# Altium project Smart_Home.PrjPcb
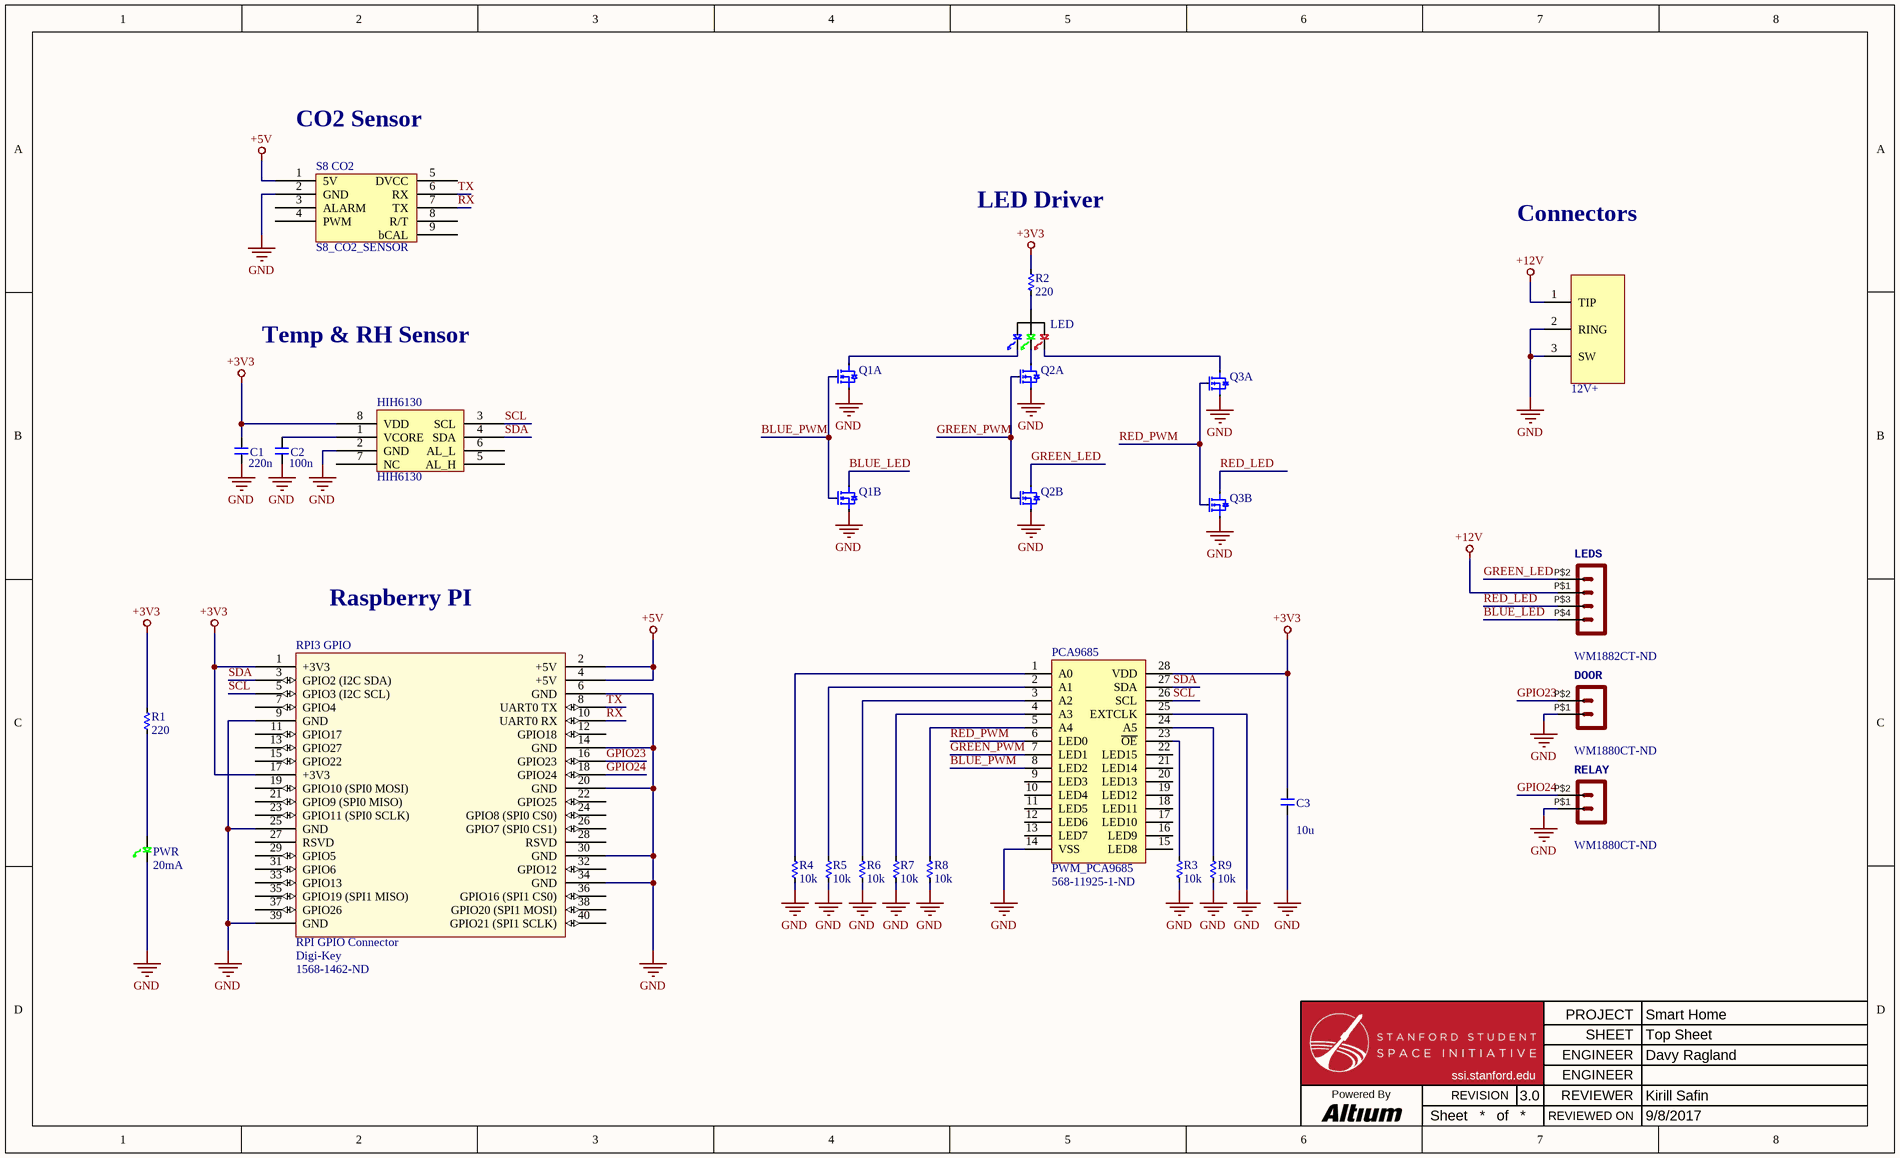
[diagram p0: TopSheet.SchDoc]
prjEngineer1: Davy Ragland; prjReviewDate: 9/8/2017; prjReviewer: Kirill Safin; prjRevision: 3.0; prjTitle: Smart Home
1 sheet, 25 parts. Net scope: strictly hierarchical (ports join the sheet entries above them; power ports are local).
Board file: TopSheet.PcbDoc

## Sheet TopSheet.SchDoc: Top Sheet
size Legal; Project: World Domination Satellite

### Parts
12V+  CONN_BARREL_21X55_PJ-102A  [CUI_21x55_BARREL]  (value not drawn)
C1  human_value: 220n  [C0805]  (hidden comment: __template_cap)
C2  human_value: 100n  [C0805]  (hidden comment: __template_cap)
C3  human_value: 10u  [C0805]  (hidden comment: __template_cap)
DOOR  Supplier Part Number 1: WM1880CT-ND  [43650-0209]  (hidden comment: Molex - Micro-Fit 3.0 Series connector,  3.00mm (0.118") pitch header, 2 positions.)
HIH6130  HIH6130  [8SOIC150]
LED  LED_LTST-C19HE1WT  [LED_LITEON_LTST-C19HE1WT]  (value not drawn)
LEDS  Supplier Part Number 1: WM1882CT-ND  [43650-0409]  (hidden comment: Molex - Micro-Fit 3.0 Series connector,  3.00mm (0.118") pitch header, 4 positions.)
PCA9685  PWM_PCA9685  Supplier Part Number 1: 568-11925-1-ND  [28TSSOP65]
PWR  Current - Test: 20mA  [0805_Diode]  (hidden comment: LED_LY971)
Q1  NFET_SI7232DN  [POWERPAK_1212-8_DUAL]  (value not drawn)  (parts A,B of 2)
Q2  NFET_SI7232DN  [POWERPAK_1212-8_DUAL]  (value not drawn)  (parts A,B of 2)
Q3  NFET_SI7232DN  [POWERPAK_1212-8_DUAL]  (value not drawn)  (parts A,B of 2)
R1  value 220  [R0805]  (hidden comment: __template_resistor)
R2  value 220  [R0805]  (hidden comment: __template_resistor)
R3  value 10k  [R0805]  (hidden comment: __template_resistor)
R4  value 10k  [R0805]  (hidden comment: __template_resistor)
R5  value 10k  [R0805]  (hidden comment: __template_resistor)
R6  value 10k  [R0805]  (hidden comment: __template_resistor)
R7  value 10k  [R0805]  (hidden comment: __template_resistor)
R8  value 10k  [R0805]  (hidden comment: __template_resistor)
R9  value 10k  [R0805]  (hidden comment: __template_resistor)
RELAY  Supplier Part Number 1: WM1880CT-ND  [43650-0209]  (hidden comment: Molex - Micro-Fit 3.0 Series connector,  3.00mm (0.118") pitch header, 2 positions.)
RPI3_GPIO  RPI GPIO Connector  Supplier 1: Digi-Key  Supplier Part Number 1: 1568-1462-ND  [rpi]
S8_CO2  S8_CO2_SENSOR  [S8 CO2 SENSOR]

### Nets
+3V3: C1.1 C3.1 HIH6130.8(VDD) PCA9685.28(VDD) R1.1 R2.1 RPI3_GPIO.1(+3V3) RPI3_GPIO.17(+3V3)
+5V: RPI3_GPIO.2(+5V) RPI3_GPIO.4(+5V) S8_CO2.1(5V)
+12V: 12V+.1(TIP) LEDS.P$1
GND: 12V+.2(RING) 12V+.3(SW) C1.2 C2.2 C3.2 DOOR.P$1 HIH6130.2(GND) PCA9685.14(VSS) PCA9685.25(EXTCLK) PWR.1 Q1.1 Q1.3 Q2.1 Q2.3 Q3.1 Q3.3 R3.2 R4.2 R5.2 R6.2 R7.2 R8.2 R9.2 RELAY.P$1 RPI3_GPIO.6(GND) RPI3_GPIO.9(GND) RPI3_GPIO.14(GND) RPI3_GPIO.20(GND) RPI3_GPIO.25(GND) RPI3_GPIO.30(GND) RPI3_GPIO.34(GND) RPI3_GPIO.39(GND) S8_CO2.2(GND)
BLUE_LED: LEDS.P$4 Q1.5
BLUE_PWM: PCA9685.8(LED2) Q1.2 Q1.4
GPIO23: DOOR.P$2 RPI3_GPIO.16(GPIO23)
GPIO24: RELAY.P$2 RPI3_GPIO.18(GPIO24)
GREEN_LED: LEDS.P$2 Q2.5
GREEN_PWM: PCA9685.7(LED1) Q2.2 Q2.4
RED_LED: LEDS.P$3 Q3.5
RED_PWM: PCA9685.6(LED0) Q3.2 Q3.4
RX: RPI3_GPIO.10(UART0_RX) S8_CO2.7(TX)
SCL: HIH6130.3(SCL) PCA9685.26(SCL) RPI3_GPIO.5(GPIO3_(I2C_SCL))
SDA: HIH6130.4(SDA) PCA9685.27(SDA) RPI3_GPIO.3(GPIO2_(I2C_SDA))
TX: RPI3_GPIO.8(UART0_TX) S8_CO2.6(RX)
NetC2_1: C2.1 HIH6130.1(VCORE)
NetLED_1: LED.1 Q3.7
NetLED_2: LED.2 Q2.7
NetLED_3: LED.3 Q1.7
NetLED_4: LED.4 R2.2
NetPCA9685_1: PCA9685.1(A0) R4.1
NetPCA9685_2: PCA9685.2(A1) R5.1
NetPCA9685_3: PCA9685.3(A2) R6.1
NetPCA9685_4: PCA9685.4(A3) R7.1
NetPCA9685_5: PCA9685.5(A4) R8.1
NetPCA9685_23: PCA9685.23(~{OE}) R3.1
NetPCA9685_24: PCA9685.24(A5) R9.1
NetPWR_2: PWR.2 R1.2

Not connected (* = marked no-connect by the designer): HIH6130 5(AL_H) 6(AL_L) 7(NC); PCA9685 9(LED3) 10(LED4) 11(LED5) 12(LED6) 13(LED7) 15(LED8) 16(LED9) 17(LED10) 18(LED11) 19(LED12) 20(LED13) 21(LED14) 22(LED15); RPI3_GPIO 7(GPIO4) 11(GPIO17) 12(GPIO18) 13(GPIO27) 15(GPIO22) 19(GPIO10_(SPI0_MOSI)) 21(GPIO9_(SPI0_MISO)) 22(GPIO25) 23(GPIO11_(SPI0_SCLK)) 24(GPIO8_(SPI0_CS0)) 26(GPIO7_(SPI0_CS1)) 27(RSVD) 28(RSVD) 29(GPIO5) 31(GPIO6) 32(GPIO12) 33(GPIO13) 35(GPIO19_(SPI1_MISO)) 36(GPIO16_(SPI1_CS0)) 37(GPIO26) 38(GPIO20_(SPI1_MOSI)) 40(GPIO21_(SPI1_SCLK)); S8_CO2 3(ALARM) 4(PWM) 5(DVCC) 8(R/T) 9(bCAL)

### Notes on the sheet
- (near S8_CO2) CO2 Sensor
- LED Driver
- Connectors
- Temp & RH Sensor
- Raspberry PI
- PROJECT
- SHEET
- Powered By
- Sheet
- of
- REVISION
- ssi.stanford.edu
- ENGINEER
- REVIEWER
- REVIEWED ON

### Library data of the parts
12V+ = CONN_BARREL_21X55_PJ-102A: CONN JACK POWER 2.1MM PCB; Manufacturer: CUI Inc; Gender: Male; Plug/Mating Plug Diameter: 2.1mm ID, 5.5mm OD; Number of Positions/Contacts: 2 Conductors, 3 Contacts; Internal Switch(s): Single Switch, Normally Closed; Shielding: Unshielded; Voltage - Rated: 16VDC; Current Rating: 2.5A; Supplier 1: Digi-Key; Manufacturer Part Number: PJ-102A; RoHS: RoHS Compliant; Category: Connectors, Interconnects; Stock 1: 149280; Pricing 1: 1=0.92, 10=0.644, 100=0.4324, 500=0.3496, 1000=0.3128, 2500=0.2484 (USD); Connector Type: Jack; Mounting Type: Through Hole, Right Angle; Termination: Solder; Features: -; Color: Black; Contact Material: Copper; Contact Material - Plating: Nickel; Housing Color: Black; Housing Material: Thermoplastic; Operating Temperature: -25°C ~ 85°C; ComponentLink1URL: http://products.cui.com/GetSpecForDigiKey.aspx?MFGNum=PJ-102A; ComponentLink1Description: Datasheet; Supplier Part Number 1: CP-102A-ND
C1 = CAP CER 0.22UF 16V 10% X7R 0805: voltage: 16.0; type: capacitor; value: 2.2e-07; tolerance: 10%; package: 0805; Supplier 1: Digikey; Supplier Part Number 1: 478-1400-1-ND; price: 0.225
C2 = CAP CER 0.1UF 50V 20% X7R 0805: voltage: 50.0; type: capacitor; value: 1e-07; tolerance: 20%; package: 0805; Supplier 1: Digikey; Supplier Part Number 1: 478-3351-1-ND; price: 0.1
C3 = CAP CER 10UF 6.3V 10% X5R 0805: voltage: 6.3; type: capacitor; value: 1e-05; tolerance: 10%; package: 0805; Supplier 1: Digikey; Supplier Part Number 1: 478-1417-1-ND; price: 0.275
DOOR RELAY = HEADER_POS2_?43650-0209: Manufacturer: Molex, LLC; Manufacturer Part Number: 0436500209; Connector Type: Header, Shrouded; Number of Positions: 2; Number of Positions Loaded: All; Pitch: 0.118" (3.00mm); Supplier 1: Digi-Key; RoHS: RoHS Compliant; Category: Connectors, Interconnects; Stock 1: 9302; Pricing 1: 1=2.03, 10=1.841, 50=1.6534, 100=1.5782 (USD); Packaging: Cut Tape (CT); Contact Type: Male Pin; Number of Rows: 1; Row Spacing: -; Contact Mating Length: -; Mounting Type: Surface Mount, Right Angle; Termination: Solder; Fastening Type: Locking Ramp; Features: Board Lock; Contact Finish: Tin; Contact Finish Thickness: 100µin (2.54µm); Color: Black; ComponentLink1URL: http://www.molex.com/pdm_docs/sd/436500210_sd.pdf; ComponentLink1Description: http://www.molex.com/pdm_docs/sd/436500210_sd.pdf
HIH6130 = HIH6130: Humidity Temperature Sensor 0 ~ 100% RH I²C ±4% RH 6s Surface Mount
LED = LED_LTST-C19HE1WT: LED RGB DIFFUSED 0606; Manufacturer: Lite-On Inc.; Lens Color: White; Millicandela Rating: 112.5mcd Red, 281mcd Green, 104mcd Blue; Lens Style/Size: Rectangle with Flat Top, 1.15mm x 1.60mm; Voltage - Forward (Vf) (Typ): 2.1V Red, 3.35V Green, 3.35V Blue; Current - Test: 20mA Red, 20mA Green, 20mA Blue; Viewing Angle: 130°; Wavelength - Dominant: 624nm Red, 525nm Green, 470nm Blue; Wavelength - Peak: 632nm Red, 520nm Green, 468nm Blue; Supplier 1: Digi-Key; Manufacturer Part Number: LTST-C19HE1WT; RoHS: RoHS Compliant; Category: Optoelectronics; Stock 1: 408608; Pricing 1: 1=0.59, 10=0.424, 25=0.3464, 100=0.277, 250=0.23372, 500=0.19912, 1000=0.15583 (USD); Packaging: Cut Tape (CT); Part Status: Active; Color: Red, Green, Blue (RGB); Lens Transparency: Diffused; Mounting Type: Surface Mount; Features: -; Package / Case: 0606 (1616 Metric); Supplier Device Package: *; Size / Dimension: 1.60mm L x 1.60mm W; Height (Max): 0.35mm; ComponentLink1URL: http://optoelectronics.liteon.com/upload/download/DS22-2008-0044/S_110_LTST-C19HE1WT.pdf; ComponentLink1Description: http://optoelectronics.liteon.com/upload/download/DS22-2008-0044/S_110_LTST-C19HE1WT.pdf; Supplier Part Number 1: 160-2162-1-ND
LEDS = HEADER_POS4_?43650-0409: Manufacturer: Molex, LLC; Manufacturer Part Number: 0436500409; Connector Type: Header, Shrouded; Number of Positions: 4; Number of Positions Loaded: All; Pitch: 0.118" (3.00mm); Supplier 1: Digi-Key; RoHS: RoHS Compliant; Category: Connectors, Interconnects; Stock 1: 1572; Pricing 1: 1=2.73, 10=2.474, 50=2.2216, 100=2.1206 (USD); Packaging: Cut Tape (CT); Contact Type: Male Pin; Number of Rows: 1; Row Spacing: -; Contact Mating Length: -; Mounting Type: Surface Mount, Right Angle; Termination: Solder; Fastening Type: Locking Ramp; Features: Board Lock; Contact Finish: Tin; Contact Finish Thickness: 100µin (2.54µm); Color: Black; ComponentLink1URL: http://www.molex.com/pdm_docs/sd/436500210_sd.pdf; ComponentLink1Description: http://www.molex.com/pdm_docs/sd/436500210_sd.pdf
PCA9685 = PWM_PCA9685: Manufacturer: NXP USA Inc.; Manufacturer Part Number: PCA9685PW,118; Internal Switch(s): Yes; Number of Outputs: 16; Voltage - Supply (Min): 2.3V; Voltage - Supply (Max): 5.5V; Current - Output / Channel: 25mA; Dimming: PWM; Supplier 1: Digi-Key; RoHS: RoHS Compliant; Category: Integrated Circuits (ICs); Stock 1: 2350; Pricing 1: 1=2.31, 10=2.075, 100=1.6644, 500=1.368, 1000=1.1324 (USD); Packaging: Cut Tape (CT); Part Status: Active; Type: Linear; Topology: -; Voltage - Output: 5.5V; Frequency: -; Applications: Backlight; Operating Temperature: -40°C ~ 85°C (TA); Mounting Type: Surface Mount; Package / Case: 28-TSSOP (0.173", 4.40mm Width); Supplier Device Package: 28-TSSOP; ComponentLink1URL: http://www.nxp.com/documents/data_sheet/PCA9685.pdf; ComponentLink1Description: http://www.nxp.com/documents/data_sheet/PCA9685.pdf
PWR = LED_LY971: LED 0805 GREEN 20MA; Manufacturer: OSRAM Opto Semiconductors Inc; Manufacturer Part Number: LG R971-KN-1; Wavelength - Dominant: 570nm; Wavelength - Peak: 572nm; Millicandela Rating: 26.05mcd; Voltage - Forward (Vf) (Typ): 2.2V; Viewing Angle: 160°; Lens Transparency: Diffused; Lens Color: White; Lens Style/Size: Rectangle with Flat Top, 1.30mm x 1.25mm; Supplier 1: Digi-Key; RoHS: RoHS Compliant; Category: Optoelectronics; Stock 1: 89733; Pricing 1: 1=0.08, 10=0.069, 100=0.0548, 250=0.04796, 500=0.04384 (USD); Packaging: Cut Tape (CT); Color: Green; Package / Case: 0805 (2012 Metric); Supplier Device Package: *; Size / Dimension: 2.00mm L x 1.25mm W; Height (Max): 0.80mm; Mounting Type: Surface Mount; ComponentLink1URL: http://www.osram-os.com/Graphics/XPic9/00078860_0.pdf; ComponentLink1Description: http://www.osram-os.com/Graphics/XPic9/00078860_0.pdf; Supplier Part Number 1: 475-1410-1-ND
Q1-Q3 = NFET_SI7232DN: MOSFET 2N-CH 20V 25A PPAK 1212-8; Manufacturer: Vishay Siliconix; Manufacturer Part Number: SI7232DN-T1-GE3; FET Type: 2 N-Channel (Dual); FET Feature: Logic Level Gate; Rds On (Max) @ Id, Vgs: 16.4 mOhm @ 10A, 4.5V; Vgs(th) (Max) @ Id: 1V @ 250µA; Gate Charge (Qg) @ Vgs: 32nC @ 8V; Input Capacitance (Ciss) @ Vds: 1220pF @ 10V; Power - Max: 23W; Supplier 1: Digi-Key; RoHS: RoHS Compliant; Category: Discrete Semiconductor Products; Stock 1: 2311; Pricing 1: 1=0.89, 10=0.782, 25=0.7344, 100=0.5994, 250=0.55672, 500=0.4738, 1000=0.37904 (USD); Packaging: Cut Tape (CT); Part Status: Active; Drain to Source Voltage (Vdss): 20V; Current - Continuous Drain (Id) @ 25°C: 25A; Operating Temperature: -55°C ~ 150°C (TJ); Mounting Type: Surface Mount; Package / Case: PowerPAK® 1212-8 Dual; Supplier Device Package: PowerPAK® 1212-8 Dual; ComponentLink1URL: http://www.vishay.com/docs/68986/si7232dn.pdf; ComponentLink1Description: http://www.vishay.com/docs/68986/si7232dn.pdf; Supplier Part Number 1: SI7232DN-T1-GE3CT-ND
R1 R2 = RES 220 OHM 1/8W 1% 0805 SMD: Manufacturer Part Number: CRCW0805220RFKEA; Manufacturer: Vishay Dale; Resistance (Machine readable): 220.00; Unit Price (USD): 0.089; Tolerance: ±1%; Power (Watts): 0.125W, 1/8W; Supplier Part Number: 541-220CCT-ND; type: resistor; Supplier 1: Digikey; Supplier Part Number 1: 541-220CCT-ND; Supplier 2: Mouser; Supplier Part Number 2: 71-CRCW0805-220-E3; Packaging: Cut Tape (CT); Series: CRCW; Package: 0805 (2012 Metric); Mouser PN Opt 1: 71-CRCW0805220RFKEA; Mouser PN Opt 2: 71-CRCW0805-220-E3
R3-R9 = RES 10.0K OHM 1/8W 1% 0805 SMD: Manufacturer Part Number: CRCW080510K0FKEA; Manufacturer: Vishay Dale; Resistance (Machine readable): 10000.00; Unit Price (USD): 0.089; Tolerance: ±1%; Power (Watts): 0.125W, 1/8W; Supplier Part Number: 541-10.0KCCT-ND; type: resistor; Supplier 1: Digikey; Supplier Part Number 1: 541-10.0KCCT-ND; Supplier 2: Mouser; Supplier Part Number 2: 71-CRCW0805-10K-E3; Packaging: Cut Tape (CT); Series: CRCW; Package: 0805 (2012 Metric); Mouser PN Opt 1: 71-CRCW080510K0FKEA; Mouser PN Opt 2: 71-CRCW0805-10K-E3
RPI3_GPIO = rpi connector: GPIO Header for Raspberry Pi A+/B+/Pi 2/Pi 3 - 2x20; Manufacturer: SparkFun Electronics; Manufacturer Part Number: PRT-14017; Nils Minor: author; nilsminor@web.de: mail; RoHS: RoHS Compliant; Category: Development Boards, Kits, Programmers; Stock 1: 150; Pricing 1: 1=1.84 (EUR); Part Status: Active; Accessory Type: Connector; For Use With/Related Products: Raspberry Pi; ComponentLink1URL: https://cdn.sparkfun.com/datasheets/Dev/RaspberryPi/12313.pdf; ComponentLink1Description: https://cdn.sparkfun.com/datasheets/Dev/RaspberryPi/12313.pdf